# Altium project PCB_Project_1.PrjPcb
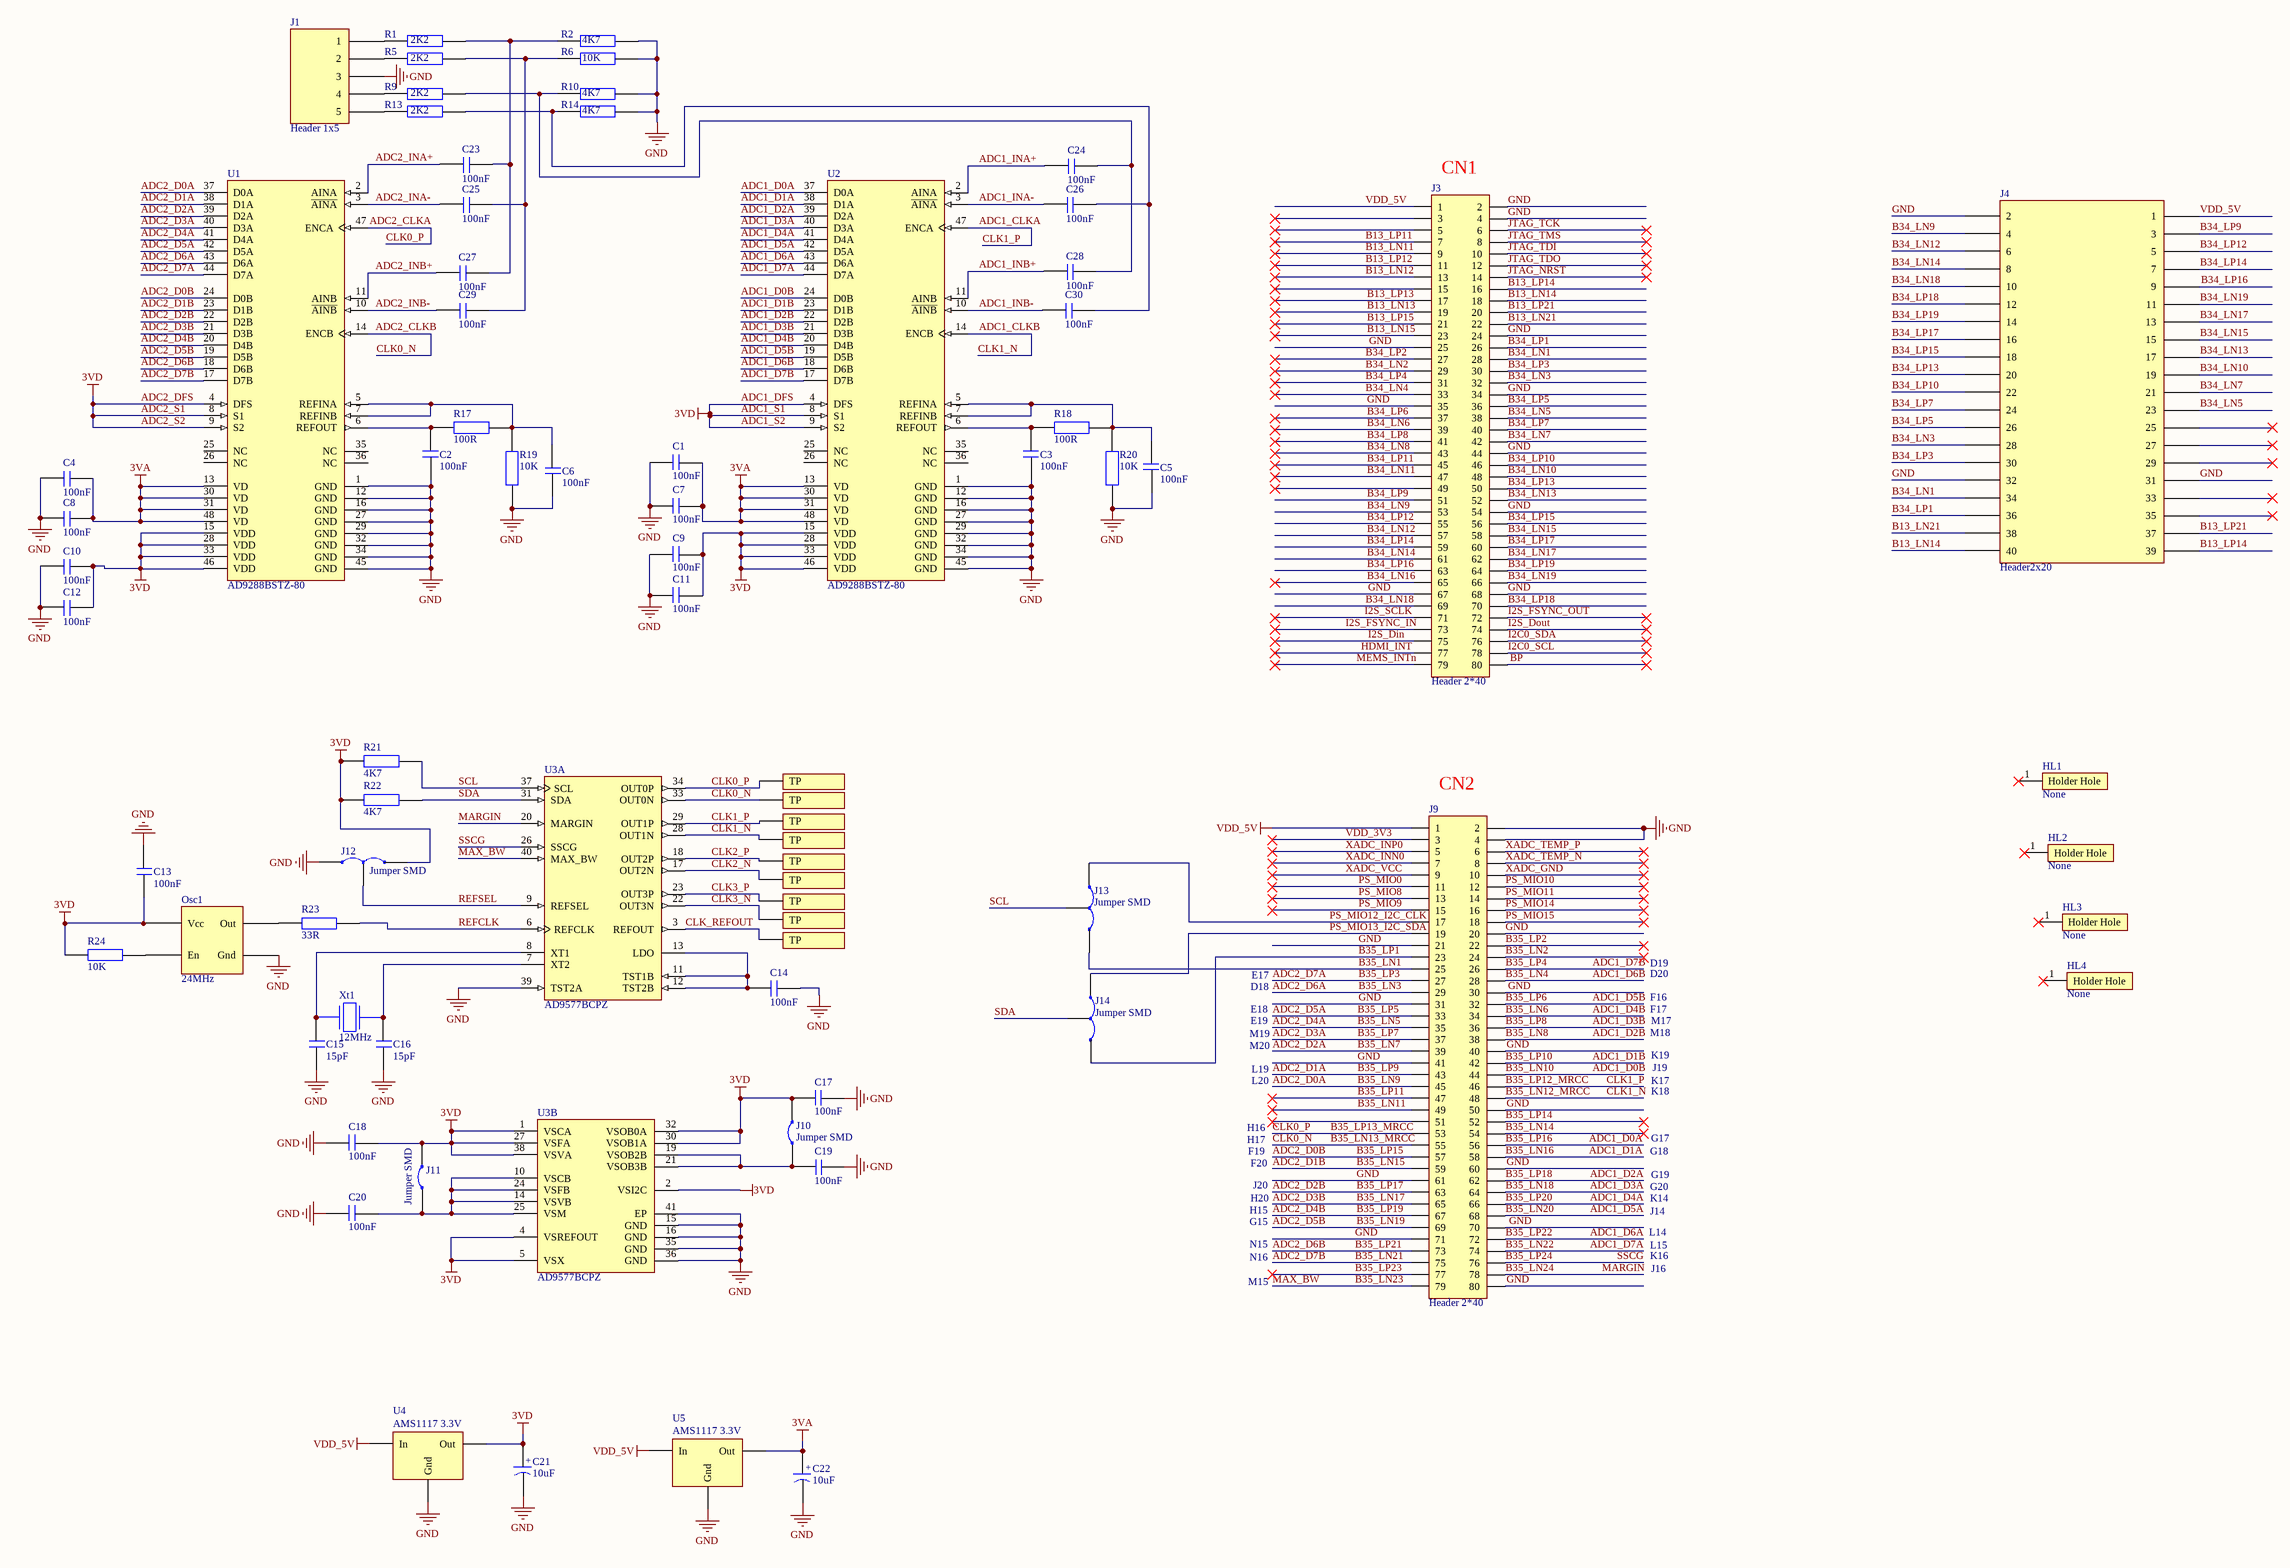
[diagram p0: Sheet1.SchDoc]
1 sheet, 75 parts. Net scope: global (net labels, ports and power ports of the same name join across sheets).
Board file: PCB1.PcbDoc

## Sheet Sheet1.SchDoc
size A2

### Parts
C1  100nF  [CAP_0805]
C2  100nF  [CAP_0805]
C3  100nF  [CAP_0805]
C4  100nF  [CAP_0805]
C5  100nF  [CAP_0805]
C6  100nF  [CAP_0805]
C7  100nF  [CAP_0805]
C8  100nF  [CAP_0805]
C9  100nF  [CAP_0805]
C10  100nF  [CAP_0805]
C11  100nF  [CAP_0805]
C12  100nF  [CAP_0805]
C13  100nF  [CAP_0805]
C14  100nF  [CAP_0805]
C15  15pF  [CAP_0805]
C16  15pF  [CAP_0805]
C17  100nF  [CAP_0805]
C18  100nF  [CAP_0805]
C19  100nF  [CAP_0805]
C20  100nF  [CAP_0805]
C21  10uF  [Cap_Tan_Size_B]
C22  10uF  [Cap_Tan_Size_B]
C23  100nF  [CAP_0805]
C24  100nF  [CAP_0805]
C25  100nF  [CAP_0805]
C26  100nF  [CAP_0805]
C27  100nF  [CAP_0805]
C28  100nF  [CAP_0805]
C29  100nF  [CAP_0805]
C30  100nF  [CAP_0805]
HL1  None  [Holder_hole]  (no BOM)
HL2  None  [Holder_hole]  (no BOM)
HL3  None  [Holder_hole]  (no BOM)
HL4  None  [Holder_hole]  (no BOM)
J1  Header 1x5  [Header_1x5]
J3  Header 2*40  [Header_2_40_1.27mm]
J4  Header2x20  [Header_2x20_female]
J9  Header 2*40  [Header_2_40_1.27mm]
J10  Jumper SMD  [Jumper_smd]  (no BOM)
J11  Jumper SMD  [Jumper_smd]  (no BOM)
J12  Jumper SMD  [Jumper_smd_3pin]  (no BOM)
J13  Jumper SMD  [Jumper_smd_3pin]  (no BOM)
J14  Jumper SMD  [Jumper_smd_3pin]  (no BOM)
Osc1  24MHz  [Osc_SMD_5x7]
R1  2K2  [RES_0805]
R2  4K7  [RES_0805]
R5  2K2  [RES_0805]
R6  10K  [RES_0805]
R9  2K2  [RES_0805]
R10  4K7  [RES_0805]
R13  2K2  [RES_0805]
R14  4K7  [RES_0805]
R17  100R  [RES_0805]
R18  100R  [RES_0805]
R19  10K  [RES_0805]
R20  10K  [RES_0805]
R21  4K7  [RES_0805]
R22  4K7  [RES_0805]
R23  33R  [RES_0805]
R24  10K  [RES_0805]
TP1  TP  [TP]  (value not drawn)  (no BOM)
TP2  TP  [TP]  (value not drawn)  (no BOM)
TP3  TP  [TP]  (value not drawn)  (no BOM)
TP4  TP  [TP]  (value not drawn)  (no BOM)
TP5  TP  [TP]  (value not drawn)  (no BOM)
TP6  TP  [TP]  (value not drawn)  (no BOM)
TP7  TP  [TP]  (value not drawn)  (no BOM)
TP8  TP  [TP]  (value not drawn)  (no BOM)
TP9  TP  [TP]  (value not drawn)  (no BOM)
U1  AD9288BSTZ-80  [LQFP-48Lead]
U2  AD9288BSTZ-80  [LQFP-48Lead]
U3  AD9577BCPZ  [LFCSP-40Lead]  (parts A,B of 2)
U4  AMS1117 3.3V  [AMS1117-SOT223]
U5  AMS1117 3.3V  [AMS1117-SOT223]
Xt1  12MHz  [Xtal_SMD]

### Nets
3VA: C1.1 C4.2 C7.1 C8.2 C22.+ U1.13(VD) U1.30(VD) U1.31(VD) U1.48(VD) U2.13(VD) U2.30(VD) U2.31(VD) U2.48(VD) U5.3(Out)
ADC1_DFS: C9.1 C10.2 C11.1 C12.2 C13.1 C17.2 C18.1 C21.+ J10.1 J11.1 J12.3 Osc1.1(Vcc) R21.1 R22.1 R24.2 U1.4(DFS) U1.8(S1) U1.9(S2) U1.15(VDD) U1.28(VDD) U1.33(VDD) U1.46(VDD) U2.4(DFS) U2.8(S1) U2.9(S2) U2.15(VDD) U2.28(VDD) U2.33(VDD) U2.46(VDD) U3.1(VSCA) U3.2(VSI2C) U3.4(VSREFOUT) U3.5(VSX) U3.27(VSFA) U3.30(VSOB1A) U3.32(VSOB0A) U3.38(VSVA) U4.3(Out)  [also labelled 3VD, ADC1_S1, ADC1_S2, ADC2_DFS, ADC2_S1, ADC2_S2]
GND: C1.2 C2.2 C3.2 C4.1 C5.2 C6.1 C7.2 C8.1 C9.2 C10.1 C11.2 C12.1 C13.2 C14.2 C15.1 C16.1 C17.1 C18.2 C19.2 C20.2 C21.- C22.- J1.3 J3.2 J3.4 J3.24 J3.25 J3.34 J3.35 J3.44 J3.54 J3.67 J3.68 J4.2 J4.31 J4.32 J9.2 J9.4 J9.20 J9.21 J9.30 J9.31 J9.40 J9.41 J9.50 J9.60 J9.61 J9.70 J9.71 J9.80 J12.1 Osc1.4(Gnd) R2.2 R6.2 R10.2 R14.2 R19.2 R20.2 U1.1(GND) U1.12(GND) U1.16(GND) U1.27(GND) U1.29(GND) U1.32(GND) U1.34(GND) U1.45(GND) U2.1(GND) U2.12(GND) U2.16(GND) U2.27(GND) U2.29(GND) U2.32(GND) U2.34(GND) U2.45(GND) U3.15(GND) U3.16(GND) U3.35(GND) U3.36(GND) U3.39(TST2A) U3.41(EP) U4.2(Gnd) U5.2(Gnd)
VDD_5V: J3.1 J4.1 J9.1 U4.1(In) U5.1(In)
ADC1_CLKA: J9.46 TP3.1(TP) U2.47(ENCA) U3.29(OUT1P)  [also labelled B35_LP12_MRCC, CLK1_P]
ADC1_CLKB: J9.48 TP4.1(TP) U2.14(ENCB) U3.28(OUT1N)  [also labelled B35_LN12_MRCC, CLK1_N]
ADC1_D0A: J9.56 U2.37(D0A)  [also labelled B35_LP16]
ADC1_D0B: J9.44 U2.24(D0B)  [also labelled B35_LN10]
ADC1_D1A: J9.58 U2.38(D1A)  [also labelled B35_LN16]
ADC1_D1B: J9.42 U2.23(D1B)  [also labelled B35_LP10]
ADC1_D2A: J9.62 U2.39(D2A)  [also labelled B35_LP18]
ADC1_D2B: J9.38 U2.22(D2B)  [also labelled B35_LN8]
ADC1_D3A: J9.64 U2.40(D3A)  [also labelled B35_LN18]
ADC1_D3B: J9.36 U2.21(D3B)  [also labelled B35_LP8]
ADC1_D4A: J9.66 U2.41(D4A)  [also labelled B35_LP20]
ADC1_D4B: J9.34 U2.20(D4B)  [also labelled B35_LN6]
ADC1_D5A: J9.68 U2.42(D5A)  [also labelled B35_LN20]
ADC1_D5B: J9.32 U2.19(D5B)  [also labelled B35_LP6]
ADC1_D6A: J9.72 U2.43(D6A)  [also labelled B35_LP22]
ADC1_D6B: J9.28 U2.18(D6B)  [also labelled B35_LN4]
ADC1_D7A: J9.74 U2.44(D7A)  [also labelled B35_LN22]
ADC1_D7B: J9.26 U2.17(D7B)  [also labelled B35_LP4]
ADC1_INA+: C24.1 U2.2(AINA)
ADC1_INA-: C26.1 U2.3(~{AINA})
ADC1_INB+: C28.1 U2.11(AINB)
ADC1_INB-: C30.1 U2.10(~{AINB})
ADC2_CLKA: J9.53 TP1.1(TP) U1.47(ENCA) U3.34(OUT0P)  [also labelled B35_LP13_MRCC, CLK0_P]
ADC2_CLKB: J9.55 TP2.1(TP) U1.14(ENCB) U3.33(OUT0N)  [also labelled B35_LN13_MRCC, CLK0_N]
ADC2_D0A: J9.45 U1.37(D0A)  [also labelled B35_LN9]
ADC2_D0B: J9.57 U1.24(D0B)  [also labelled B35_LP15]
ADC2_D1A: J9.43 U1.38(D1A)  [also labelled B35_LP9]
ADC2_D1B: J9.59 U1.23(D1B)  [also labelled B35_LN15]
ADC2_D2A: J9.39 U1.39(D2A)  [also labelled B35_LN7]
ADC2_D2B: J9.63 U1.22(D2B)  [also labelled B35_LP17]
ADC2_D3A: J9.37 U1.40(D3A)  [also labelled B35_LP7]
ADC2_D3B: J9.65 U1.21(D3B)  [also labelled B35_LN17]
ADC2_D4A: J9.35 U1.41(D4A)  [also labelled B35_LN5]
ADC2_D4B: J9.67 U1.20(D4B)  [also labelled B35_LP19]
ADC2_D5A: J9.33 U1.42(D5A)  [also labelled B35_LP5]
ADC2_D5B: J9.69 U1.19(D5B)  [also labelled B35_LN19]
ADC2_D6A: J9.29 U1.43(D6A)  [also labelled B35_LN3]
ADC2_D6B: J9.73 U1.18(D6B)  [also labelled B35_LP21]
ADC2_D7A: J9.27 U1.44(D7A)  [also labelled B35_LP3]
ADC2_D7B: J9.75 U1.17(D7B)  [also labelled B35_LN21]
ADC2_INA+: C23.1 U1.2(AINA)
ADC2_INA-: C25.1 U1.3(~{AINA})
ADC2_INB+: C27.1 U1.11(AINB)
ADC2_INB-: C29.1 U1.10(~{AINB})
B13_LN11: J3.9
B13_LN12: J3.13
B13_LN13: J3.19
B13_LN14: J3.18 J4.40
B13_LN15: J3.23
B13_LN21: J3.22 J4.38
B13_LP11: J3.7
B13_LP12: J3.11
B13_LP13: J3.17
B13_LP14: J3.16 J4.39
B13_LP15: J3.21
B13_LP21: J3.20 J4.37
B34_LN1: J3.28 J4.34
B34_LN2: J3.29
B34_LN3: J3.32 J4.28
B34_LN4: J3.33
B34_LN5: J3.38 J4.23
B34_LN6: J3.39
B34_LN7: J3.42 J4.21
B34_LN8: J3.43
B34_LN9: J3.53 J4.4
B34_LN10: J3.48 J4.19
B34_LN11: J3.47
B34_LN12: J3.57 J4.6
B34_LN13: J3.52 J4.17
B34_LN14: J3.61 J4.8
B34_LN15: J3.58 J4.15
B34_LN16: J3.65
B34_LN17: J3.62 J4.13
B34_LN18: J3.69 J4.10
B34_LN19: J3.66 J4.11
B34_LP1: J3.26 J4.36
B34_LP2: J3.27
B34_LP3: J3.30 J4.30
B34_LP4: J3.31
B34_LP5: J3.36 J4.26
B34_LP6: J3.37
B34_LP7: J3.40 J4.24
B34_LP8: J3.41
B34_LP9: J3.51 J4.3
B34_LP10: J3.46 J4.22
B34_LP11: J3.45
B34_LP12: J3.55 J4.5
B34_LP13: J3.50 J4.20
B34_LP14: J3.59 J4.7
B34_LP15: J3.56 J4.18
B34_LP16: J3.63 J4.9
B34_LP17: J3.60 J4.16
B34_LP18: J3.70 J4.12
B34_LP19: J3.64 J4.14
B35_LN1: J9.25 J13.3
B35_LN2: J9.24
B35_LN11: J9.49
B35_LN14: J9.54
B35_LN23: J9.79 U3.40(MAX_BW)  [also labelled MAX_BW]
B35_LN24: J9.78 U3.20(MARGIN)  [also labelled MARGIN]
B35_LP1: J9.23 J14.3
B35_LP2: J9.22
B35_LP11: J9.47
B35_LP14: J9.52
B35_LP23: J9.77
B35_LP24: J9.76 U3.26(SSCG)  [also labelled SSCG]
BP: J3.80
CLK2_N: TP6.1(TP) U3.17(OUT2N)
CLK2_P: TP5.1(TP) U3.18(OUT2P)
CLK3_N: TP8.1(TP) U3.22(OUT3N)
CLK3_P: TP7.1(TP) U3.23(OUT3P)
CLK_REFOUT: TP9.1(TP) U3.3(REFOUT)
HDMI_INT: J3.77
I2C0_SCL: J3.78
I2C0_SDA: J3.76
I2S_Din: J3.75
I2S_Dout: J3.74
I2S_FSYNC_IN: J3.73
I2S_FSYNC_OUT: J3.72
I2S_SCLK: J3.71
JTAG_NRST: J3.14
JTAG_TCK: J3.6
JTAG_TDI: J3.10
JTAG_TDO: J3.12
JTAG_TMS: J3.8
MEMS_INTn: J3.79
PS_MIO0: J9.11
PS_MIO8: J9.13
PS_MIO9: J9.15
PS_MIO10: J9.12
PS_MIO11: J9.14
PS_MIO12_I2C_CLK: J9.17 J13.1
PS_MIO13_I2C_SDA: J9.19 J14.1
PS_MIO14: J9.16
PS_MIO15: J9.18
REFCLK: R23.2 U3.6(REFCLK)
REFSEL: J12.2 U3.9(REFSEL)
SCL: J13.2 R21.2 U3.37(SCL)
SDA: J14.2 R22.2 U3.31(SDA)
VDD_3V3: J9.3
XADC_GND: J9.10
XADC_INN0: J9.7
XADC_INP0: J9.5
XADC_TEMP_N: J9.8
XADC_TEMP_P: J9.6
XADC_VCC: J9.9
NetC2_1: C2.1 R17.1 U1.6(REFOUT)
NetC3_1: C3.1 R18.2 U2.6(REFOUT)
NetC5_1: C5.1 R18.1 R20.1 U2.5(REFINA) U2.7(REFINB)
NetC6_2: C6.2 R17.2 R19.1 U1.5(REFINA) U1.7(REFINB)
NetC14_1: C14.1 U3.11(TST1B) U3.12(TST2B) U3.13(LDO)
NetC15_2: C15.2 U3.8(XT1) Xt1.2
NetC16_2: C16.2 U3.7(XT2) Xt1.1
NetC19_1: C19.1 J10.2 U3.19(VSOB2B) U3.21(VSOB3B)
NetC20_1: C20.1 J11.2 U3.10(VSCB) U3.14(VSVB) U3.24(VSFB) U3.25(VSM)
NetC23_2: C23.2 C27.2 R1.2 R2.1
NetC24_2: C24.2 C28.2 R9.2 R10.1
NetC25_2: C25.2 C29.2 R5.2 R6.1
NetC26_2: C26.2 C30.2 R13.2 R14.1
NetJ1_1: J1.1 R1.1
NetJ1_2: J1.2 R5.1
NetJ1_4: J1.4 R9.1
NetJ1_5: J1.5 R13.1
NetOsc1_2: Osc1.2(En) R24.1
NetOsc1_3: Osc1.3(Out) R23.1

Not connected (* = marked no-connect by the designer): HL1 1(Holder_Hole)*; HL2 1(Holder_Hole)*; HL3 1(Holder_Hole)*; HL4 1(Holder_Hole)*; J3 3* 5* 15* 49*; J4 25* 27* 29* 33* 35*; J9 51*; U1 25(NC) 26(NC) 35(NC) 36(NC); U2 25(NC) 26(NC) 35(NC) 36(NC)

### Notes on the sheet
- (near J3) CN1
- (near J9) CN2
- D18
- E17
- D19
- D20
- M20
- M19
- E19
- E18
- F16
- F17
- M18
- M17
- L20
- L19
- K19
- K17
- K18
- J19
- H16
- H17
- F19
- F20
- G18
- G17
- H15
- G15
- H20
- J20
- G20
- K14
- J14
- G19
- M15
- N15
- N16
- L14
- L15
- K16
- J16

### Library data of the parts
C1-C20 C23-C30 = Cap0805: Capacitor SMD 0805
C21 C22 = Cap_Tant_B: Capacitor SMD Tantalium Size B
HL1-HL4 = Holder_Hole: PCB Holder Hole
J1 = Header_1x5: Header 5-pin
J3 J9 = Header_2_40_1.27mm
J4 = Header2x20: Pin Header 2x20 pitch=2.54mm
J10 J11 = Jump_smd
J12-J14 = Jump_smd_3tap
Osc1 = Osc_SMD: Oscillator SMD 5x7; pin to pad: 1>Vcc 2>EN 3>Out 4>Gnd
R1 R2 R5 R6 R9 R10 R13 R14 R17-R24 = Res0805: Resistor SMD 0805
TP1-TP9 = TP: Test point
U1 U2 = AD9288BSTZ-80: Dual 8-Bit Analog-to-Digital Converter with Parallel Interface, 80MSPS, -40 to +85 degC, ST-48, Pb-Free, Tray; Generic Part Number: AD9288-80; Manufacturer: Analog Devices; Resolution (Bits): 8; Channels: 2; Throughput Rate (SPS): 80M; Interface: Par; DatasheetVersion: Rev.C; PackageVersion: revA; PackageReference: ST-48; PackageDescription: 48-Pin Thin Quad Flat Pack 0.5 mm Pitch; Supplier 1: Digi-Key; Supplier Part Number 1: AD9288BSTZ-80-ND; Supplier 2: Farnell; Supplier Part Number 2: 2312996; Supplier 3: Newark; Supplier Part Number 3: 82H3063; Supplier 4: Mouser; Supplier Part Number 4: 584-AD9288BSTZ-80; RoHS: Y; Packing: Tray; Mounting Technology: Surface Mount; PartNumber: AD9288BSTZ-80; ComponentLink1Description: Manufacturer URL; ComponentLink1URL: http://www.analog.com/en/index.html; ComponentLink2Description: Datasheet; ComponentLink2URL: http://www.analog.com/static/imported-files/data_sheets/AD9288.pdf; ComponentLink3Description: Package Specification; ComponentLink3URL: http://www.analog.com/static/imported-files/packages/PKG_PDF/LQFP%28ST%29/ST_48.pdf; ComponentLink4Description: Product URL; ComponentLink4URL: http://www.analog.com/en/analog-to-digital-converters/ad-converters/ad9288/products/product.html
U3 = AD9577BCPZ: Clock Generator with Dual PLLs, Spread Spectrum, and Margining, 3.3 V Supply, Industrial, 40-pin QFN (CP-40-7), Tray; Manufacturer: Analog Devices; # of Inputs: 1; # of Outputs: 8; Supply Voltage (V): 3.3; I/O Interface: Serial; Max f-out: 637.5 MHz; On-Chip VCO or DCO: Yes; Output Logic: LVCMOS, LVDS, LVPECL; DatasheetVersion: Rev. 0; PackageVersion: 012909-B, 02/2009; PackageReference: CP-40-7; PackageDescription: 40-Pin Lead Frame Chip Scale Package, Body 6 x 6 mm, Pitch 0.5 mm; Supplier 1: Digi-Key; Supplier Part Number 1: AD9577BCPZ-ND; Supplier 2: Mouser; Supplier Part Number 2: 584-AD9577BCPZ; Packing: Tray; Mounting Technology: Surface Mount; Code_JEDEC: MO-220-WJJD; PartNumber: AD9577BCPZ; ComponentLink1Description: Manufacturer URL; ComponentLink1URL: http://www.analog.com/en/index.html; ComponentLink2Description: Datasheet; ComponentLink2URL: http://www.analog.com/static/imported-files/data_sheets/AD9577.pdf; ComponentLink3Description: Package Specification; ComponentLink3URL: http:/www.analog.com/static/imported-files/packages/PKG_PDF/LFCSP(CP)/CP-40/CP_40_7.pdf; ComponentLink4Description: Product URL; ComponentLink4URL: http://www.analog.com/en/clock-and-timing/clock-generation-and-distribution/ad9577/products/product.html
U4 U5 = AMS1117-SOT223: AMS1117 Regulator 3.3V SMD SOT223; pin to pad: 1>In 2>Gnd_Adj 3>Out
Xt1 = Xtal_SMD: Crystal Oscillator SMD